# EasyEDA schematic SCH_200MW三角图传_2026-02-01.json

## Parts
BUTTON1  SW-PB  [SKRKAEE020]
C1  104  [0402_C]
C2  102  [0402_C]
C3  106  [0402_C]
C4  6.8pF  [0402_C]
C5  10uF  [0402_C]
C6  10uF  [0402_C]
C7  20pF  [0402_C]
C8  4.7uF  [0402_C]
C9  1uF  [0402_C]
C10  475  [0402_C]
C11  6.8pF  [0402_C]
C12  0.4pF  [0402_C]
C13  0.5pF  [0402_C]
C14  22pF  [0402_C]
C15  4.7uF  [0402_C]
C16  102  [0402_C]
C17  1uF  [0402_C]
C18  102  [0402_C]
C19  10pF  [0402_C]
C20  22pF  [0402_C]
C21  470nF  [0402_C]
C22  104  [0402_C]
C23  1uF  [0402_C]
C24  33pF  [0402_C]
C25  4.7uF  [0402_C]
C26  104  [0402_C]
C27  104  [0402_C]
C28  104  [0402_C]
C29  105  [0603_C]
C30  105  [0402_C]
C31  105  [0603_C]
C32  105  [0402_C]
C33  22nF  [0402_C]
D1  红灯  [0402_LED]
D2  绿灯  [0402_LED]
D3  蓝灯  [0402_LED]
L1  1nH  [0402_L]
L2  1nH  [0402_L]
L3  4.7nH  [0402_L]
L4  15nH  [0402_L]
P1  IPEX  [IPEX1___]
P2  Header 4  [1.7_4P]
P3  Pad  [PAD_0.8MM]
P4  Pad  [PAD_0.8MM]
Q1  CJ2101  [SOT-323(SC-70)]
R1  3.3K  [0402_R]
R2  10R  [0402_R]
R3  51R  [0402_R]
R4  0R  [0402_R]
R5  20k  [0402_R]
R6  100k  [0402_R]
R7  2.2K  [0402_R]
R8  220  [0402_R]
R9  10K  [0402_R]
R10  510K  [0402_R]
R11  1.2k  [0402_R]
R12  560k  [0402_R]
R13  10K  [0402_R]
R14  1.2k  [0402_R]
R15  75R  [0402_R]
R16  270R  [0402_R]
R17  1k  [0402_R]
R18  1k  [0402_R]
R19  1k  [0402_R]
U1  RTC6659E  [QFN-16_3X3X05P]
U2  RTC6705  [QFN-40_6X6X05P]
U3  GD32F130Gx  [QFN28_4X4X0.9]
U4  RS3236-3.3YUTDN  [UTDFN-1X1-4]
U5  RT9193  [SOT-23-5]
Y1  8MHz  [SMD-3225_4P]

## Library data of the parts
BUTTON1 = -: Published: 24-Mar-1999; LatestRevisionDate: 17-Jul-2002; LatestRevisionNote: Re-released for DXP Platform.; PackageReference: SPST-2; Publisher: Altium Limited; PackageDescription: Switch; 2 Leads
C1-C33 = -: ComponentLink1Description: 供应商链接; ComponentLink1URL: http://www.szlcsc.com/product/details_53938.html; Supplier: LC; SuppliersPartNumber: C52923
D1 = -: ComponentLink1Description: 供应商链接; ComponentLink1URL: http://www.szlcsc.com/product/details_2659.html; Supplier: LC; SuppliersPartNumber: C2286
D2 = -: ComponentLink1Description: 供应商链接; ComponentLink1URL: http://www.szlcsc.com/product/details_73152.html; Supplier: LC; SuppliersPartNumber: C72043
D3 = -: ComponentLink1Description: 供应商链接; ComponentLink1URL: http://www.szlcsc.com/product/details_73150.html; Supplier: LC; SuppliersPartNumber: C72041
P2 = -: LatestRevisionDate: 17-Jul-2002; LatestRevisionNote: Re-released for DXP Platform.; Publisher: Altium Limited
Q1 = -: ComponentLink1Description: 供应商链接; ComponentLink1URL: http://www.szlcsc.com/product/details_15801.html; Supplier: LC; SuppliersPartNumber: C15127
R1-R19 = -: ComponentLink1Description: 供应商链接; ComponentLink1URL: http://www.szlcsc.com/product/details_17853.html; Supplier: LC; SuppliersPartNumber: C17168

## Nets
3V3: C8.1 C10.2 C22.2 C23.1 C32.2 Q1.2(S) R3.2 R10.2 U2.8(VDD33_DIG) U2.9(V2D5_PLL) U2.22(VDD3V3) U2.30(VDDVT) U2.31(BUFVDD) U2.32(PAVDD) U2.39(VCOVDD) U5.5(VOUT)
GND: BUTTON1.1(2) C1.2 C2.2 C3.2 C5.1 C6.1 C7.1 C8.2 C9.2 C10.1 C12.1 C13.1 C14.1 C15.1 C16.2 C17.2 C18.1 C19.1 C20.2 C21.2 C22.1 C23.2 C26.1 C27.1 C28.1 C29.2 C30.2 C31.1 C32.1 C33.2 D1.K D2.K D3.K P1.2(GND) P2.1 R9.2 R12.2 R13.1 R15.1 R16.2 U1.0(EP) U1.1(NC) U1.5(NC) U1.6(NC) U1.9(NC) U1.13(NC) U1.15(NC) U2.0(EP) U2.28(GND) U2.33(RFGND) U2.37(NC) U2.38(GND) U3.16(VSS) U3.29(EP) U4.2(GND) U4.5(BP) U5.2(GND) Y1.2 Y1.4
VDD: C27.2 C28.2 C30.1 U3.5(VDDA) U3.17(VDD) U4.1(OUT)
+5: C1.1 C2.1 C3.1 C18.2 C29.1 C31.2 L1.2 L2.2 L3.2 P2.2 U1.7(VCCB) U4.3(EN) U4.4(IN) U5.1(VIN) U5.3(EN)
LED1: R17.1 U3.10(PA4)
LED2: R18.1 U3.9(PA3)
LED3: R19.1 U3.8(PA2)
RFIN: C4.1 U1.2(RFIN) U1.3(RFIN)
RTCBIAS: R1.1 U3.26(PB5)
SPICLK: U2.7(SPICLK/CS2) U3.23(PA15)
SPIMOSI: R8.2 U3.25(PB4)
SPISS: U2.6(SPILE/CS1) U3.24(PB3)
SWCLK: P4.1(P) U3.22(PA14)
SWDIO: P3.1(P) U3.21(PA13)
UARTRX: P2.4 U3.19(PA9)
VIDEOIN: C24.2 P2.3 R14.1 R15.2
VPD: C19.2 R7.1 R9.1 U3.6(PA0)
VREF: C16.1 R4.2 U3.7(PA1)
Net-(BUTTON1-2): BUTTON1.2(1) U3.12(PA6)
Net-(C4-2): C4.2 L4.2 U2.35(PAOUT1)
Net-(C5-2): C5.2 Q1.1(G) R1.2
Net-(C6-2): C6.2 Q1.3(D) R2.1
Net-(C7-2): C7.2 L4.1 R2.2
Net-(C9-1): C9.1 R3.1 U2.40(LDO2V5)
Net-(C11-1): C11.1 P1.1(Signal)
Net-(C11-2): C11.2 C12.2 C13.2 U1.10(RFOUT/VCC3) U1.11(RFOUT/VCC3)
Net-(C14-2): C14.2 U2.25(XTAL2) Y1.1
Net-(C15-2): C15.2 R5.2
Net-(C17-1): C17.1 R5.1 R6.2 U2.29(VT)
Net-(C20-1): C20.1 U2.24(XTAL1) Y1.3
Net-(C21-1): C21.1 U2.23(REG1D8_1)
Net-(C24-1): C24.1 C25.1 R14.2 R16.1
Net-(C25-2): C25.2 R11.2
Net-(C26-2): C26.2 U3.4(NRST)
Net-(C33-1): C33.1 U5.4(BP)
Net-(D1-A): D1.A R17.2
Net-(D2-A): D2.A R18.2
Net-(D3-A): D3.A R19.2
Net-(L1-1): L1.1 U1.16(VCC1)
Net-(L2-1): L2.1 U1.14(VCC2)
Net-(L3-1): L3.1 U1.12(RFOUT/VCC3)
Net-(R4-1): R4.1 U1.4(VREF)
Net-(R6-1): R6.1 U2.27(CP)
Net-(R7-2): R7.2 U1.8(PD)
Net-(R8-1): R8.1 U2.5(SPIDATA/CS0)
Net-(R10-1): R10.1 R11.1 R12.1 U2.10(VT_Mod)
Net-(R13-2): R13.2 U3.1(BOOT0)

Not connected (* = marked no-connect by the designer): U2 1(SPI_SE)* 2(NC)* 3(S)* 4(BX)* 11(RF_VT2)* 12(NC)* 13(AVDD_6)* 14(AVT1)* 15(ACP1)* 16(AOUT1)* 17(AVDD_6.5)* 18(NC)* 19(AOUT2)* 20(ACP2)* 21(AVT2)* 26(REG1D8) 34(PAOUT2) 36(NC); U3 2(OSCIN/PF0) 3(OSCOUT/PF1) 11(PA5) 13(PA7) 14(PB0) 15(PB1) 18(PA8) 20(PA10) 27(PB6) 28(PB7)

## Notes on the sheet
- PA
- 射频电路
- MCU
- 图传接口
- LED灯
- LDOMCU
- LDO
- 下载接口
